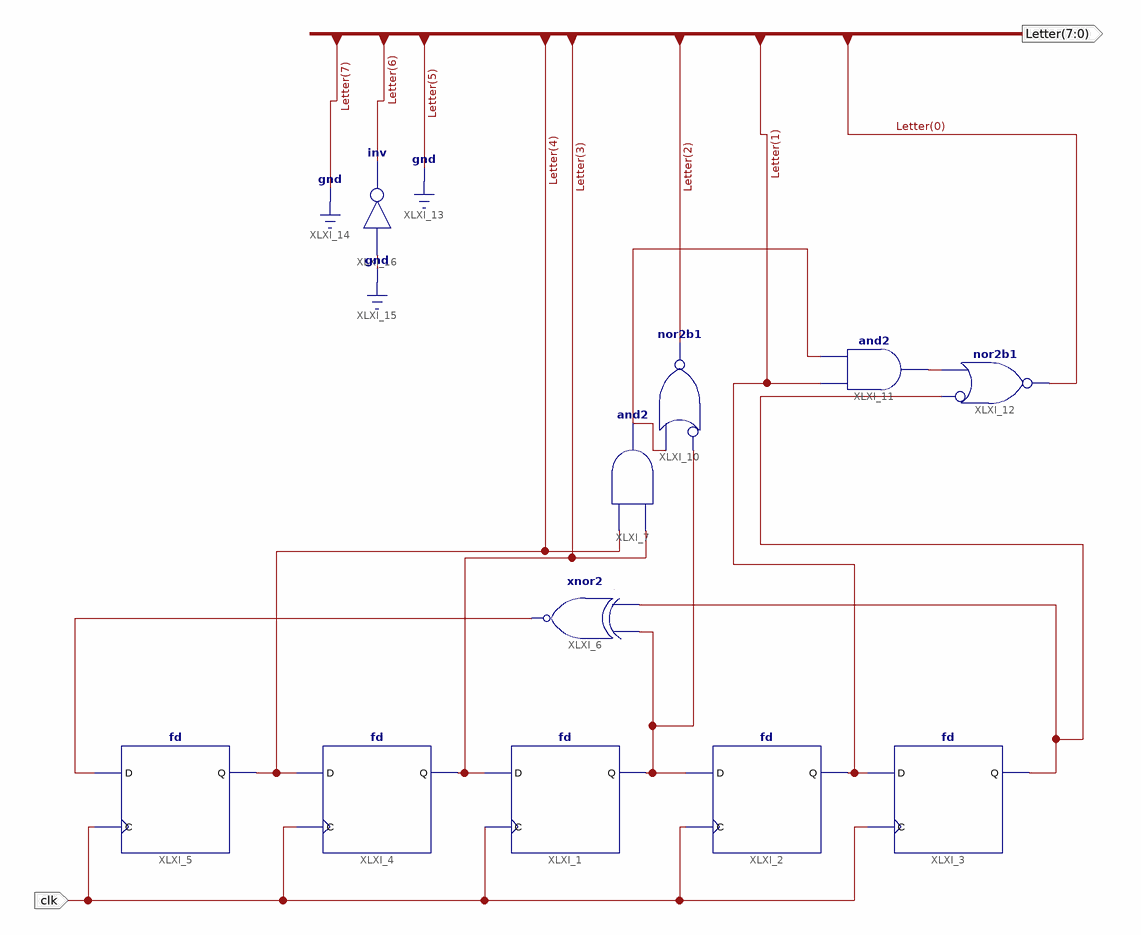
[diagram p0: schematic sheet 1]
// Xilinx ISE schematic LetterGenerator.sch (aspartan6) as structural Verilog: 11 symbols, 2 ports
module LetterGenerator (
  input  clk,
  output [7:0] Letter
);

  wire I1, XLXN_23, XLXN_45, XLXN_48, XLXN_49;

  fd XLXI_1 (.C(clk), .D(Letter[3]), .Q(XLXN_23));
  fd XLXI_2 (.C(clk), .D(XLXN_23), .Q(Letter[1]));
  fd XLXI_3 (.C(clk), .D(Letter[1]), .Q(XLXN_49));
  fd XLXI_4 (.C(clk), .D(Letter[4]), .Q(Letter[3]));
  fd XLXI_5 (.C(clk), .D(I1), .Q(Letter[4]));
  xnor XLXI_6 (I1, XLXN_49, XLXN_23);
  and XLXI_7 (XLXN_45, Letter[3], Letter[4]);
  nor XLXI_10 (Letter[2], ~XLXN_23, XLXN_45);  // nor2b1
  and XLXI_11 (XLXN_48, Letter[1], XLXN_45);
  nor XLXI_12 (Letter[0], ~XLXN_49, XLXN_48);  // nor2b1
  not XLXI_16 (Letter[6], 1'b0);

  assign {Letter[7], Letter[5]} = 2'b00;
endmodule
